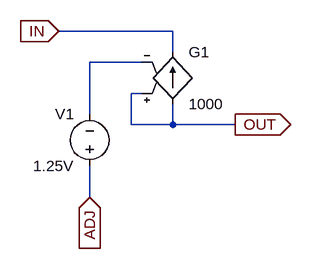
[diagram p0: schematic IdealNegRegulator.asc]
IdealNegRegulator.asc, the LTspice schematic file:
Version 4
SHEET 1 880 680
WIRE 192 80 16 80
WIRE 192 112 192 80
WIRE 144 128 64 128
WIRE 144 176 128 176
WIRE 64 208 64 128
WIRE 128 224 128 176
WIRE 192 224 192 192
WIRE 192 224 128 224
WIRE 288 224 192 224
WIRE 64 336 64 288
FLAG 16 80 IN
IOPIN 16 80 In
FLAG 288 224 OUT
IOPIN 288 224 Out
FLAG 64 336 ADJ
IOPIN 64 336 In
SYMBOL g2 192 96 R0
SYMATTR InstName G1
SYMATTR Value 1000
SYMBOL voltage 64 304 R180
WINDOW 0 24 96 Left 2
WINDOW 3 24 16 Left 2
SYMATTR InstName V1
SYMATTR Value 1.25V

The netlist it stands for:
* IdealNegRegulator.asc
G1 OUT IN OUT N001 1000
V1 ADJ N001 1.25V
.backanno
.end